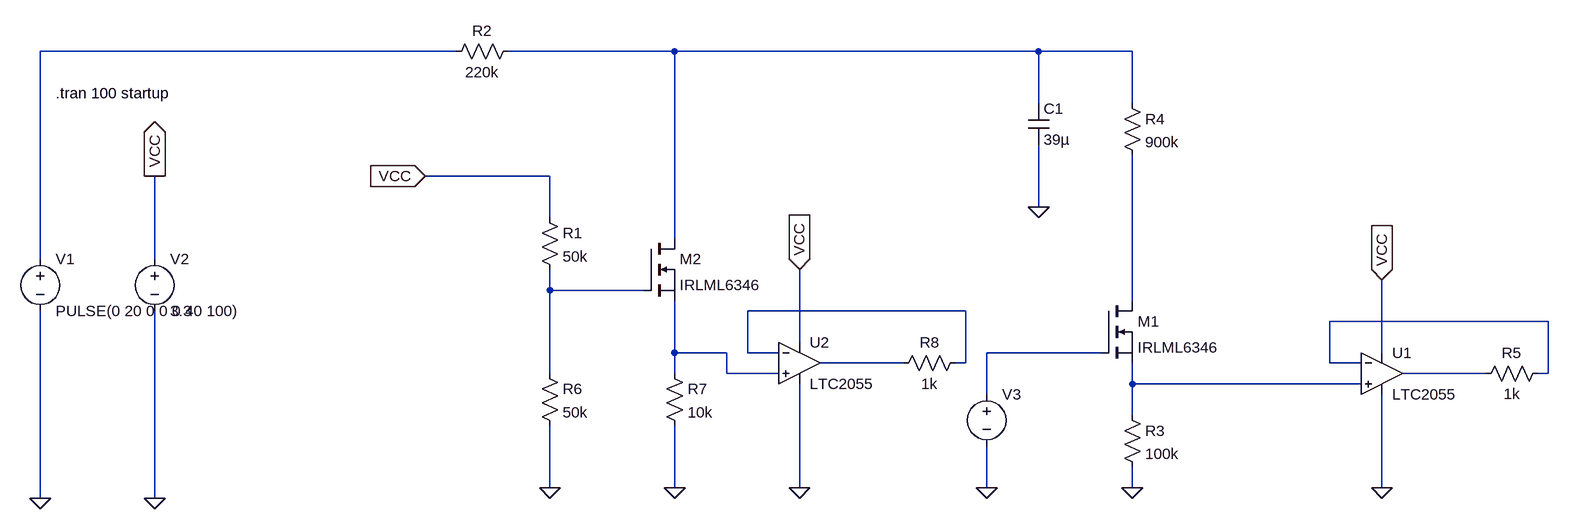
[diagram p0: schematic piezo_measure.asc]
piezo_measure.asc, the LTspice schematic file:
Version 4
SHEET 1 2684 1620
WIRE 208 -176 -432 -176
WIRE 544 -176 288 -176
WIRE 1104 -176 544 -176
WIRE 1248 -176 1104 -176
WIRE 1104 -96 1104 -176
WIRE 1248 -96 1248 -176
WIRE 352 16 160 16
WIRE 1104 64 1104 -32
WIRE 352 80 352 16
WIRE 544 112 544 -176
WIRE -432 144 -432 -176
WIRE -256 144 -256 16
WIRE 352 192 352 160
WIRE 496 192 352 192
WIRE 1248 208 1248 -16
WIRE 992 224 656 224
WIRE 1888 240 1552 240
WIRE 736 272 736 160
WIRE 544 288 544 208
WIRE 624 288 544 288
WIRE 656 288 656 224
WIRE 704 288 656 288
WIRE 1200 288 1024 288
WIRE 1632 288 1632 176
WIRE 896 304 768 304
WIRE 992 304 992 224
WIRE 992 304 976 304
WIRE 1552 304 1552 240
WIRE 1600 304 1552 304
WIRE 352 320 352 192
WIRE 544 320 544 288
WIRE 624 320 624 288
WIRE 704 320 624 320
WIRE 1792 320 1664 320
WIRE 1888 320 1888 240
WIRE 1888 320 1872 320
WIRE 1248 336 1248 304
WIRE 1600 336 1248 336
WIRE 1024 352 1024 288
WIRE 1248 384 1248 336
WIRE 352 496 352 400
WIRE 544 496 544 400
WIRE 736 496 736 336
WIRE 1024 496 1024 432
WIRE 1248 496 1248 464
WIRE 1632 496 1632 352
WIRE -432 512 -432 224
WIRE -256 512 -256 224
FLAG -432 512 0
FLAG -256 512 0
FLAG -256 16 VCC
IOPIN -256 16 Out
FLAG 160 16 VCC
IOPIN 160 16 In
FLAG 1104 64 0
FLAG 1248 496 0
FLAG 1024 496 0
FLAG 1632 496 0
FLAG 1632 176 VCC
IOPIN 1632 176 In
FLAG 352 496 0
FLAG 544 496 0
FLAG 736 496 0
FLAG 736 160 VCC
IOPIN 736 160 In
SYMBOL voltage -432 128 R0
WINDOW 123 0 0 Left 2
WINDOW 39 0 0 Left 2
SYMATTR InstName V1
SYMATTR Value PULSE(0 20 0 0 0 40 100)
SYMBOL voltage -256 128 R0
WINDOW 123 0 0 Left 2
WINDOW 39 0 0 Left 2
SYMATTR InstName V2
SYMATTR Value 3.3
SYMBOL res 192 -160 R270
WINDOW 0 32 56 VTop 2
WINDOW 3 0 56 VBottom 2
SYMATTR InstName R2
SYMATTR Value 220k
SYMBOL cap 1088 -96 R0
SYMATTR InstName C1
SYMATTR Value 39µ
SYMBOL nmos 1200 208 R0
SYMATTR InstName M1
SYMATTR Value IRLML6346
SYMBOL voltage 1024 336 R0
WINDOW 3 24 96 Invisible 2
WINDOW 123 0 0 Left 2
WINDOW 39 0 0 Left 2
SYMATTR InstName V3
SYMATTR Value PULSE(0 3.3 0.1 10u 10u 4m 100m 10000)
SYMBOL res 1232 368 R0
SYMATTR InstName R3
SYMATTR Value 100k
SYMBOL res 1232 -112 R0
SYMATTR InstName R4
SYMATTR Value 900k
SYMBOL Opamps\\LTC2055 1632 320 R0
SYMATTR InstName U1
SYMBOL res 1888 304 R90
WINDOW 0 0 56 VBottom 2
WINDOW 3 32 56 VTop 2
SYMATTR InstName R5
SYMATTR Value 1k
SYMBOL res 336 64 R0
SYMATTR InstName R1
SYMATTR Value 50k
SYMBOL res 336 304 R0
SYMATTR InstName R6
SYMATTR Value 50k
SYMBOL nmos 496 112 R0
SYMATTR InstName M2
SYMATTR Value IRLML6346
SYMBOL res 528 304 R0
SYMATTR InstName R7
SYMATTR Value 10k
SYMBOL Opamps\\LTC2055 736 304 R0
SYMATTR InstName U2
SYMBOL res 992 288 R90
WINDOW 0 0 56 VBottom 2
WINDOW 3 32 56 VTop 2
SYMATTR InstName R8
SYMATTR Value 1k
TEXT -408 -112 Left 2 !.tran 100 startup

The netlist it stands for:
* piezo_measure.asc
V1 N001 0 PULSE(0 20 0 0 0 40 100)
V2 VCC 0 3.3
R2 N001 N002 220k
C1 N002 0 39µ
M1 N004 N008 N011 N011 IRLML6346
V3 N008 0 PULSE(0 3.3 0.1 10u 10u 4m 100m 10000)
R3 N011 0 100k
R4 N002 N004 900k
XU1 N011 N006 N010 VCC 0 LTC2054  ; LTC2055, pins In+ In- OUT V+ V-
R5 N006 N010 1k
R1 VCC N003 50k
R6 N003 0 50k
M2 N002 N003 N007 N007 IRLML6346
R7 N007 0 10k
XU2 N007 N005 N009 VCC 0 LTC2054  ; LTC2055, pins In+ In- OUT V+ V-
R8 N005 N009 1k
.model NMOS NMOS
.model PMOS PMOS
.lib standard.mos
.tran 100 startup
.lib LTC2.lib
.backanno
.end